# Altium schematic sheet Main_sheet.SchDoc
size A; Author: Shaheem; SheetNumber: 1; SheetTotal: 1
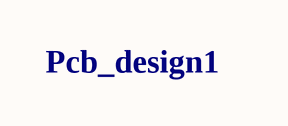
[diagram p0: Main_sheet.SchDoc]

## Notes on the sheet
- Pcb_design1